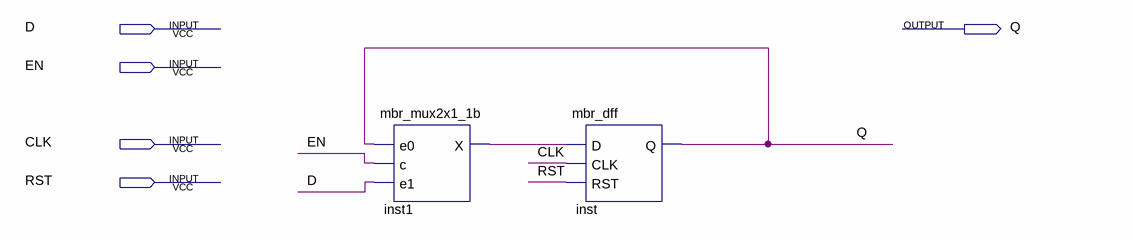
[diagram p0: schematic sheet]
// Quartus schematic mbr_reg_1b.bdf as structural Verilog: 2 symbols, 5 pins
module mbr_reg_1b (
  input  D,
  input  EN,
  input  CLK,
  input  RST,
  output Q
);

  wire inst1_x;

  mbr_mux2x1_1b inst1 (.e0(Q), .c(EN), .e1(D), .X(inst1_x));
  mbr_dff inst (.D(inst1_x), .CLK(CLK), .RST(RST), .Q(Q));
endmodule
